# Altium schematic sheet Battery2.SchDoc
size A
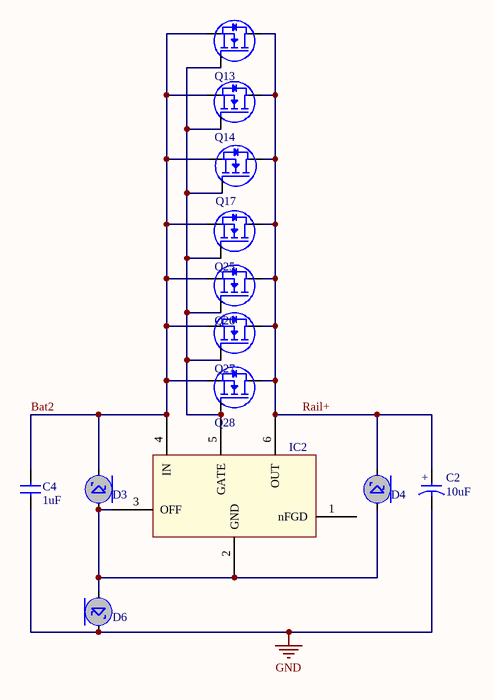
[diagram p0: Battery2.SchDoc]

## Parts
C2  value 10uF  [CAP22uF100V]  (hidden comment: CapPol)
C4  value 1uF  [CAPC1206]  (hidden comment: Cap)
D3  Schottky  [SS110-TP]  (value not drawn)
D4  SMBJ100A-13-F  [SMBJ100A-13-F]  (value not drawn)
D6  Schottky  [SS110-TP]  (value not drawn)
IC2  LM5050MK-2/NOPB  [LM5050MK-2/NOPB]  (value not drawn)
Q13  CSD19502Q5B  [CSD19502Q5B]  (value not drawn)
Q14  CSD19502Q5B  [CSD19502Q5B]  (value not drawn)
Q17  CSD19502Q5B  [CSD19502Q5B]  (value not drawn)
Q25  CSD19502Q5B  [CSD19502Q5B]  (value not drawn)
Q26  CSD19502Q5B  [CSD19502Q5B]  (value not drawn)
Q27  CSD19502Q5B  [CSD19502Q5B]  (value not drawn)
Q28  CSD19502Q5B  [CSD19502Q5B]  (value not drawn)

## Nets
GND: C2.2(B) C4.2(B) D6.C
Bat2: C4.1(A) D3.C IC2.4(IN) Q13.S Q14.S Q17.S Q25.S Q26.S Q27.S Q28.S
Rail+: C2.1(A) D4.C IC2.6(OUT) Q13.D Q14.D Q17.D Q25.D Q26.D Q27.D Q28.D
NetD3_A: D3.A D4.A D6.A IC2.2(GND) IC2.3(OFF)
NetIC2_5: IC2.5(GATE) Q13.G Q14.G Q17.G Q25.G Q26.G Q27.G Q28.G

Not connected (* = marked no-connect by the designer): IC2 1(nFGD)

## Notes on the sheet
- (in symbol CapPol) +

## Library data of the parts
D3 D6 = Schottky: Schottky Diode Template; Supplier 1: Digi-Key; Supplier Part Number 1: SS110-TPDKR-ND
D4 = SMBJ100A-13-F: TVS DIODE 100VWM 162VC SMB; Supplier 1: Digi-Key; Supplier Part Number 1: SMBJ100A-FDIDKR-ND
IC2 = LM5050MK-2/NOPB: IC OR CTRLR N+1 6SOT; Supplier 1: Digi-Key; Supplier Part Number 1: LM5050MK-2/NOPBDKR-ND
Q13 Q14 Q17 Q25-Q28 = CSD19502Q5B: NEXFET Power MOSFET; Supplier 1: Digi-Key; Supplier Part Number 1: 296-37194-1-ND
C2 = CapPol: Supplier 1: Digi-Key; Supplier Part Number 1: P5853-ND
C4 = Cap: Supplier 1: Digi-Key; Supplier Part Number 1: 587-1777-1-ND